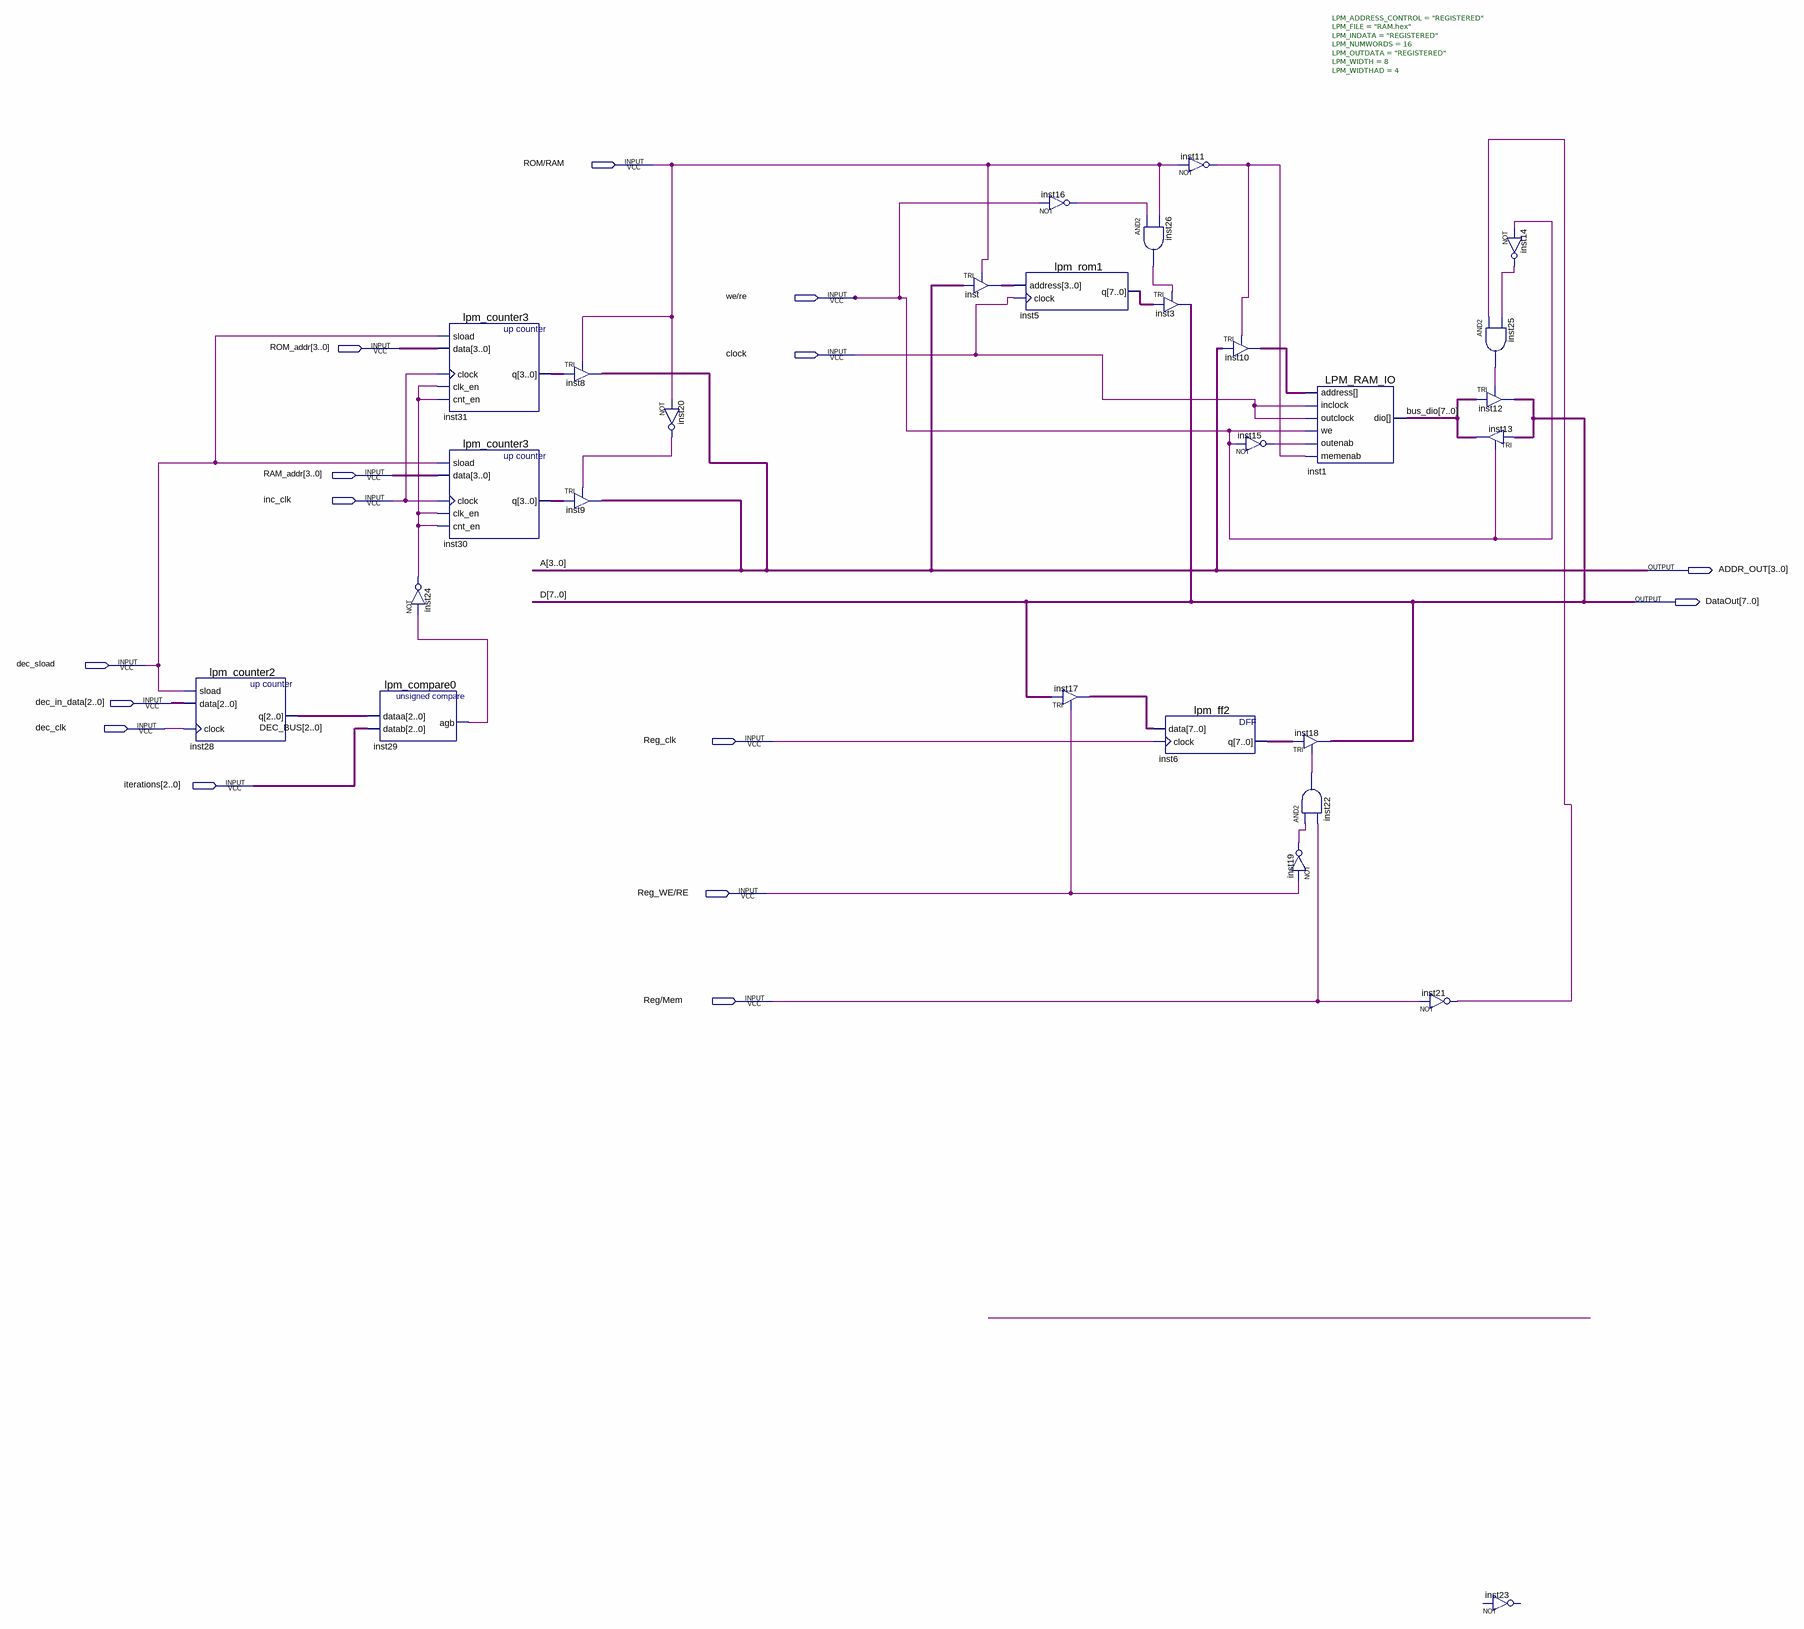
[diagram p0: schematic sheet]
// Quartus schematic Lab_3.bdf as structural Verilog: 28 symbols, 15 pins
module Lab_3 (
  input  \ROM/RAM ,
  input  \we/re ,
  input  [3:0] ROM_addr,
  input  clock,
  input  [3:0] RAM_addr,
  input  inc_clk,
  input  dec_sload,
  input  [2:0] dec_in_data,
  input  dec_clk,
  input  Reg_clk,
  input  [2:0] iterations,
  input  \Reg_WE/RE ,
  input  \Reg/Mem ,
  output [3:0] ADDR_OUT,
  output [7:0] DataOut
);

  wire inst11_out, inst14_out, inst15_out, inst16_out, inst19_out, inst20_out, inst21_out, inst22_out,
       inst24_out, inst25_out, inst26_out, inst29_agb;
  wire [2:0] DEC_BUS;
  wire [3:0] inst10_out, inst30_q, inst31_q, inst_out;
  wire [7:0] bus_dio, inst5_q, inst6_q, inst17_out;

  lpm_counter2 inst28 (.sload(dec_sload), .data(dec_in_data), .clock(dec_clk), .q(DEC_BUS));
  lpm_compare0 inst29 (.dataa(DEC_BUS), .datab(iterations), .agb(inst29_agb));
  not inst24 (inst24_out, inst29_agb);
  lpm_counter3 inst31 (
    .sload(dec_sload), .data(ROM_addr), .clock(inc_clk), .clk_en(inst24_out), .cnt_en(inst24_out),
    .q(inst31_q));
  lpm_counter3 inst30 (
    .sload(dec_sload), .data(RAM_addr), .clock(inc_clk), .clk_en(inst24_out), .cnt_en(inst24_out),
    .q(inst30_q));
  TRI inst8[3:0] (.IN(inst31_q), .OE(\ROM/RAM ), .OUT(ADDR_OUT));
  TRI inst9[3:0] (.IN(inst30_q), .OE(inst20_out), .OUT(ADDR_OUT));
  not inst20 (inst20_out, \ROM/RAM );
  TRI inst[3:0] (.IN(ADDR_OUT), .OE(\ROM/RAM ), .OUT(inst_out));
  not inst16 (inst16_out, \we/re );
  lpm_rom1 inst5 (.address(inst_out), .clock(clock), .q(inst5_q));
  TRI inst17[7:0] (.IN(DataOut), .OE(\Reg_WE/RE ), .OUT(inst17_out));
  and inst26 (inst26_out, inst16_out, \ROM/RAM );
  not inst11 (inst11_out, \ROM/RAM );
  TRI inst3[7:0] (.IN(inst5_q), .OE(inst26_out), .OUT(DataOut));
  lpm_ff2 inst6 (.data(inst17_out), .clock(Reg_clk), .q(inst6_q));
  TRI inst10[3:0] (.IN(ADDR_OUT), .OE(inst11_out), .OUT(inst10_out));
  not inst15 (inst15_out, \we/re );
  TRI inst18[7:0] (.IN(inst6_q), .OE(inst22_out), .OUT(DataOut));
  and inst22 (inst22_out, inst19_out, \Reg/Mem );
  not inst19 (inst19_out, \Reg_WE/RE );
  LPM_RAM_IO #(.LPM_ADDRESS_CONTROL("REGISTERED"), .LPM_FILE("RAM.hex"), .LPM_INDATA("REGISTERED"), .LPM_NUMWORDS(16), .LPM_OUTDATA("REGISTERED"), .LPM_WIDTH(8), .LPM_WIDTHAD(4)) inst1 (
    .address(inst10_out), .outclock(clock), .memenab(inst11_out), .inclock(clock), .we(\we/re ),
    .outenab(inst15_out), .dio(bus_dio));
  not inst21 (inst21_out, \Reg/Mem );
  and inst25 (inst25_out, inst21_out, inst14_out);
  TRI inst12[7:0] (.IN(bus_dio), .OE(inst25_out), .OUT(DataOut));
  TRI inst13[7:0] (.IN(DataOut), .OE(\we/re ), .OUT(bus_dio));
  // NOT inst23 is placed but not wired
  not inst14 (inst14_out, \we/re );

  // Other names for the same wires on the sheet: A[3:0] = ADDR_OUT; D[7:0] = DataOut
endmodule
